# Altium schematic sheet [04] POWER.SchDoc
size A
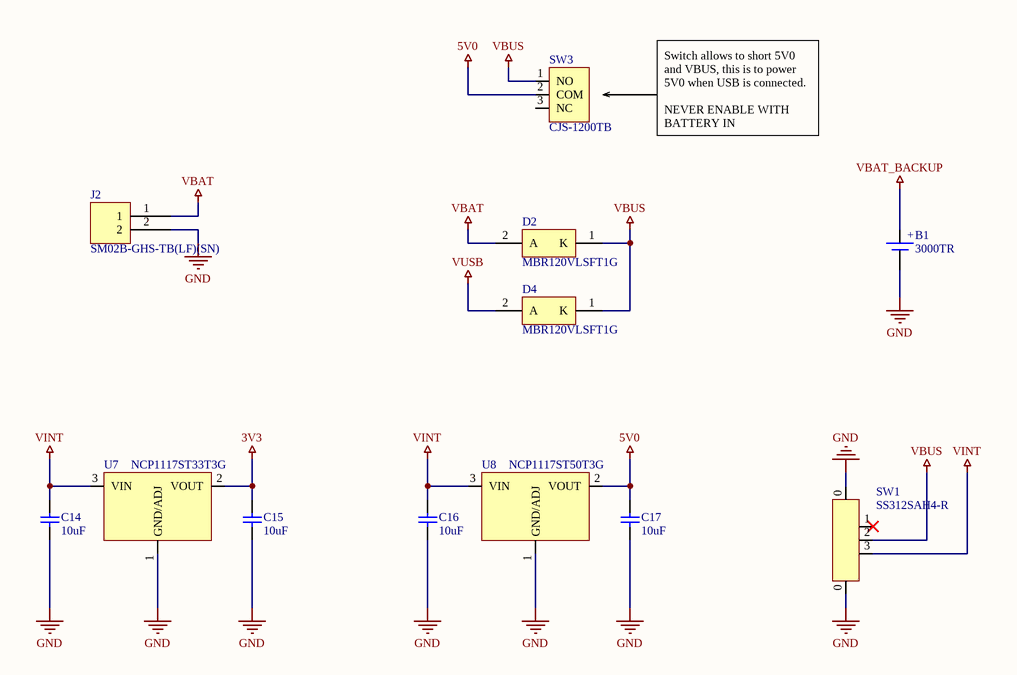
[diagram p0: [04] POWER.SchDoc]

## Parts
B1  3000TR  [3000TR]
C14  10uF  [INCH 0805 - METRIC 2012 - H140]
C15  10uF  [INCH 0805 - METRIC 2012 - H140]
C16  10uF  [INCH 0805 - METRIC 2012 - H140]
C17  10uF  [INCH 0805 - METRIC 2012 - H140]
D2  MBR120VLSFT1G  [ONSC-SOD-123FL-2-498-01_V]
D4  MBR120VLSFT1G  [ONSC-SOD-123FL-2-498-01_V]
J2  SM02B-GHS-TB(LF)(SN)  [SM02B-GHS-TB(LF)(SN)]
SW1  SS312SAH4-R  [NKK_SS312SAH4]
SW3  CJS-1200TB  [NCE_CJS-1200TB]
U7  NCP1117ST33T3G  [SOT223-4P230_700X180L90X70]
U8  NCP1117ST50T3G  [SOT223-4P230_700X180L90X70]

## Nets
3V3: C15.2 U7.2(VOUT)
5V0: C17.2 SW3.2(COM) U8.2(VOUT)
GND: B1.2(-) C14.1 C15.1 C16.1 C17.1 J2.2 SW1.0 U7.1(GND/ADJ) U8.1(GND/ADJ)
VBAT: D2.2(A) J2.1
VBAT_BACKUP: B1.1(+)
VBUS: D2.1(K) D4.1(K) SW1.2 SW3.1(NO)
VINT: C14.2 C16.2 SW1.3 U7.3(VIN) U8.3(VIN)
VUSB: D4.2(A)

Not connected (* = marked no-connect by the designer): SW1 1*; SW3 3(NC)

## Notes on the sheet
- Switch allows to short 5V0 and VBUS, this is to power 5V0 when USB is connected.
  NEVER ENABLE WITH BATTERY IN

## Library data of the parts
B1 = 3000TR: HOLDER BATTERY COIN 12MM DIA SMD; Manufacturer: Keystone Electronics; Connector Type: SMD/SMT; Number of Cells: 1; Supplier 1: Digi-Key; Manufacturer Part Number: 3000TR; RoHS: Yes; Category: Power Management ICs; Stock 1: 23941; Pricing 1: 1=0.91000, 25=0.79880, 100=0.63390, 250=0.58356, 500=0.54802 (USD); Mount: Surface Mount,PCB; Case/Package: SMD/SMT; Material: Bronze; Color: Silver; Packaging: Tape and Reel; Package Quantity: 1; Termination: SMD/SMT; Number of Batteries: 1; Diameter: 12mm; Lead Free: Lead Free; ComponentLink1URL: https://datasheet.ciiva.com/3/3000-3936.pdf?src-supplier=Digi-Key; ComponentLink1Description: https://datasheet.ciiva.com/3/3000-3936.pdf?src-supplier=Digi-Key; ComponentLink2URL: https://datasheet.ciiva.com/3/3000tr-3935.pdf?src-supplier=Digi-Key; ComponentLink2Description: https://datasheet.ciiva.com/3/3000tr-3935.pdf?src-supplier=Digi-Key; ComponentLink3URL: https://datasheet.ciiva.com/16305/m60-2p7-16305915.pdf?src-supplier=Future+Electronics; ComponentLink3Description: https://datasheet.ciiva.com/16305/m60-2p7-16305915.pdf?src-supplier=Future+Electronics; ComponentLink4URL: https://datasheet.ciiva.com/3/3000tr-3937.pdf?src-supplier=Digi-Key; ComponentLink4Description: https://datasheet.ciiva.com/3/3000tr-3937.pdf?src-supplier=Digi-Key; Supplier Part Number 1: 36-3000CT-ND
C14-C17 = GRM21BR61E106MA73L: CAP CER 10UF 25V X5R 0805; Manufacturer: Murata; Tolerance: 20%; Supplier 1: Digi-Key; Manufacturer Part Number: GRM21BR61E106MA73L; Stock 1: 30000; Pricing 1: 1=0.27, 10=0.184, 100=0.1044, 500=0.0737, 1000=0.06449 (USD); Mount: Surface Mount; Case/Package: 0805; Weight: 0.000335oz; Case Code (Metric): 2012; Case Code (Imperial): 0805; Min Operating Temperature: -55°C; Max Operating Temperature: 85°C; Capacitance: 10uF; Packaging: Tape and Reel; Dielectric: X5R; Voltage Rating: 25V; Termination: SMD/SMT; Composition: Ceramic; Voltage Rating (DC): 25V; Package Quantity: 3000; Length: 2mm; Height: 1.25mm; Width: 0.049inch; Thickness: 0.055inch; Depth: 1.25mm; REACH SVHC: No SVHC; Lead Free: Lead Free; Supplier Part Number 1: 490-10748-1-ND
D2 D4 = CMP-1055-00449-1: Schottky Power Rectifier, 2-Pin SOD-123, Pb-Free, Tape and Reel; Manufacturer: On Semiconductor; IFSM Max (A): 45; Configuration: Single; PackageDescription: 2-Pin SOD, Body 1.65 x 2.7 mm; RoHS: TRUE; ComponentLink2URL: http://www.onsemi.cn/pub_link/Collateral/MBR120VLSFT1-D.PDF; Mounting Technology: Surface Mount; ComponentLink1Description: Manufacturer URL; DatasheetVersion: Rev. 2; ComponentLink3Description: Package Specification; Packing: Tape and Reel; ComponentLink2Description: Datasheet; ComponentLink1URL: http://www.onsemi.com/; PackageVersion: Rev. A; PackageReference: SOD-123FL-2-498-01; ComponentLink3URL: http://www.onsemi.cn/pub_link/Collateral/MBR120VLSFT1-D.PDF; PartNumber: MBR120VLSFT1G
J2 = SM02B-GHS-TB(LF)(SN): Connector Header, GH Series, 2 Position, 1.25mm, 30-26 AWG, 50V, Surface Mount, Right Angle, Solder, Locking Ramp; Manufacturer: JST; Number of Positions: 2; Connector Type: Outer Shroud Contact; Current Rating: 1A; Pitch: 0.049inch; Supplier 1: Digi-Key; Manufacturer Part Number: SM02B-GHS-TB(LF)(SN); RoHS: Yes; Category: Headers and Wire Housings; Stock 1: 14162; Pricing 1: 1=0.46000, 10=0.43800, 100=0.30670, 500=0.26292, 1000=0.21910 (USD); Mount: Surface Mount; Housing Material: Nylon; Color: Natural; Contact Material: Bronze; Housing Color: Natural; Contact Plating: Tin; Number of Rows: 1; Fastening Type: Ramp; Packaging: Tape and Reel; Termination: Solder; Number of Contacts: 2; Voltage Rating: 50V; Orientation: Right Angle; Lead Free: Lead Free; ComponentLink1URL: https://datasheet.ciiva.com/25617/0900766b810cef17-25617252.pdf?src-supplier=RSComponents; ComponentLink1Description: https://datasheet.ciiva.com/25617/0900766b810cef17-25617252.pdf?src-supplier=RSComponents; ComponentLink2URL: https://datasheet.ciiva.com/730/egh-730691.pdf?src-supplier=Digi-Key; ComponentLink2Description: https://datasheet.ciiva.com/730/egh-730691.pdf?src-supplier=Digi-Key; ComponentLink3URL: https://datasheet.ciiva.com/712/egh-712452.pdf?src-supplier=Digi-Key; ComponentLink3Description: https://datasheet.ciiva.com/712/egh-712452.pdf?src-supplier=Digi-Key; ComponentLink4URL: https://datasheet.ciiva.com/16345/jstsm02b-ghs-tb-lf-sn-16345351.pdf?src-supplier=Future+Electronics; ComponentLink4Description: https://datasheet.ciiva.com/16345/jstsm02b-ghs-tb-lf-sn-16345351.pdf?src-supplier=Future+Electronics; Supplier Part Number 1: 455-1564-1-ND
SW1 = SS312SAH4-R: SWITCH SLIDE SPDT 0.4VA 28V; Manufacturer: NKK Switches; Actuator Material: Polyphenylene; Mechanical Life: 10000Cycles; Max Current Rating: 100mA; Switch Travel: 2mm; Switch Function: On-On; Actuator Type: Standard; Supplier 1: Digi-Key; Manufacturer Part Number: SS312SAH4-R; RoHS: Yes; Stock 1: 6697; Pricing 1: 1 = 3.33000, 10 = 3.18800, 25 = 3.04920, 50 = 2.70280, 100 = 2.63340, 250 = 2.59876 (USD); Mount: Surface Mount; Case/Package: SMD/SMT; Contact Material: Bronze; Contact Plating: Gold,Silver; Housing Material: Bronze; Min Operating Temperature: -25°C; Max Operating Temperature: 85°C; Packaging: Tape and Reel; Package Quantity: 500; Throw Configuration: SPDT; Voltage Rating (AC): 28V; Max Voltage Rating (AC): 28V; Max Voltage Rating (DC): 28V; Termination: Gull Wing; Voltage Rating (DC): 28V; Electrical Life: 10000Cycles; Orientation: Right Angle; Length: 10.5mm; Depth: 7.45mm; Actuator Length: 2mm; Lead Free: Lead Free; REACH SVHC: No SVHC; ComponentLink1URL: http://www.farnell.com/datasheets/1783587.pdf?src-supplier=Element14; ComponentLink1Description: http://www.farnell.com/datasheets/1783587.pdf?src-supplier=Element14; Supplier Part Number 1: 360-2924-1-ND
SW3 = CJS-1200TB: SWITCH SLIDE SPDT 100MA 6V; Manufacturer: Nidec Copal; Body Material: Polyphenylene; Max Voltage Rating (DC): 24V; Number of Positions: 2; Electrical Life: 200Cycles; Washable: Yes; Supplier 1: Digi-Key; Manufacturer Part Number: CJS-1200TB; Stock 1: 0; Mount: Surface Mount; Contact Material: Copper Alloy; Contact Plating: Gold; Min Operating Temperature: -40°C; Max Operating Temperature: 85°C; Throw Configuration: SPDT; Packaging: Tape and Reel; Termination: Gull Wing; Voltage Rating (DC): 6V; Current Rating: 100mA; Orientation: Vertical; Length: 0.212inch; Radiation Hardening: No; Lead Free: Lead Free; ComponentLink1URL: https://datasheet.ciiva.com/2865/cjs-2865057.pdf; ComponentLink1Description: https://datasheet.ciiva.com/2865/cjs-2865057.pdf; ComponentLink2URL: https://datasheet.ciiva.com/2865/cjs-2865058.pdf; ComponentLink2Description: https://datasheet.ciiva.com/2865/cjs-2865058.pdf; ComponentLink3URL: https://datasheet.ciiva.com/2865/cjs-2865059.pdf; ComponentLink3Description: https://datasheet.ciiva.com/2865/cjs-2865059.pdf; Supplier Part Number 1: 563-1022-1-ND
U7 = NCP1117ST33T3G: IC REG LINEAR 3.3V 1A SOT223; Manufacturer: ON Semiconductor; Max Input Voltage: 20V; Number of Outputs: 1; Dropout Voltage: 1.07V; Max Supply Voltage: 15V; Min Supply Voltage: 4.75V; Min Input Voltage: 3.5V; Input Bias Current: 6mA; Quiescent Current: 10mA; Polarity: Positive; Reference Voltage: 1.25V; Accuracy: 1%; Output Type: Fixed; Supplier 1: Digi-Key; Manufacturer Part Number: NCP1117ST33T3G; RoHS: Yes; Stock 1: 60671; Pricing 1: 1 = 0.52000, 10 = 0.44400, 100 = 0.33150, 500 = 0.26048, 1000 = 0.20129 (USD); Mount: Surface Mount; Case/Package: SOT-223; Number of Pins: 3; Contact Plating: Tin; Min Operating Temperature: 0°C; Max Operating Temperature: 125°C; Output Voltage: 3.3V; Packaging: Tape and Reel; Output Current: 1A; Max Output Current: 1A; Package Quantity: 1; Nominal Output Voltage: 3.3V; Number of Regulators: 1; Min Current Limit: 1A; Min Output Voltage: 3.3V; Max Output Voltage: 3.3V; Termination: SMD/SMT; Output Voltage Accuracy: 1%; Length: 6.7mm; Height: 1.69mm; Width: 3.7mm; Radiation Hardening: No; REACH SVHC: No SVHC; Lead Free: Lead Free; Halogen Free: Halogen Free; ComponentLink1URL: https://datasheet.ciiva.com/3224/ncp1117-d-3224144.pdf?src-supplier=Avnet; ComponentLink1Description: https://datasheet.ciiva.com/3224/ncp1117-d-3224144.pdf?src-supplier=Avnet; ComponentLink2URL: https://datasheet.ciiva.com/22697/1726422-22697602.pdf?src-supplier=Element14; ComponentLink2Description: https://datasheet.ciiva.com/22697/1726422-22697602.pdf?src-supplier=Element14; ComponentLink3URL: https://datasheet.ciiva.com/15111/getdatasheetpartid-82718-15111483.pdf?src-supplier=Verical; ComponentLink3Description: https://datasheet.ciiva.com/15111/getdatasheetpartid-82718-15111483.pdf?src-supplier=Verical; ComponentLink4URL: https://datasheet.ciiva.com/8233/ncp1117-d-8233589.pdf?src-supplier=Avnet; ComponentLink4Description: https://datasheet.ciiva.com/8233/ncp1117-d-8233589.pdf?src-supplier=Avnet; ComponentLink5URL: https://datasheet.ciiva.com/2042/ncp1117-d-2042027.pdf?src-supplier=Digi-Key; ComponentLink5Description: https://datasheet.ciiva.com/2042/ncp1117-d-2042027.pdf?src-supplier=Digi-Key; ComponentLink6URL: https://datasheet.ciiva.com/2042/ncp1117-d-2042028.pdf?src-supplier=Digi-Key; ComponentLink6Description: https://datasheet.ciiva.com/2042/ncp1117-d-2042028.pdf?src-supplier=Digi-Key; ComponentLink7URL: https://datasheet.ciiva.com/2042/ncp1117-d-2042029.pdf?src-supplier=Digi-Key; ComponentLink7Description: https://datasheet.ciiva.com/2042/ncp1117-d-2042029.pdf?src-supplier=Digi-Key; ComponentLink8URL: https://datasheet.ciiva.com/8073/1726422-8073735.pdf?src-supplier=Element14; ComponentLink8Description: https://datasheet.ciiva.com/8073/1726422-8073735.pdf?src-supplier=Element14; ComponentLink9URL: https://datasheet.ciiva.com/28483/1748260-28483307.pdf?src-supplier=Element14; ComponentLink9Description: https://datasheet.ciiva.com/28483/1748260-28483307.pdf?src-supplier=Element14; ComponentLink10URL: https://datasheet.ciiva.com/16382/ncp1117-d-16382636.pdf?src-supplier=Future+Electronics; ComponentLink10Description: https://datasheet.ciiva.com/16382/ncp1117-d-16382636.pdf?src-supplier=Future+Electronics; Supplier Part Number 1: NCP1117ST33T3GOSCT-ND
U8 = NCP1117ST50T3G: IC REG LINEAR 5V 1A SOT223; Manufacturer: ON Semiconductor; Number of Outputs: 1; Max Input Voltage: 20V; Min Input Voltage: 3.5V; Dropout Voltage: 1.2V; Input Bias Current: 6mA; Polarity: Positive; Quiescent Current: 10mA; Output Voltage Accuracy: 1%; Power Rating: 781mW; Output Type: Fixed; Supplier 1: Digi-Key; Manufacturer Part Number: NCP1117ST50T3G; RoHS: Yes; Stock 1: 20727; Pricing 1: 1 = 0.54000, 10 = 0.45800, 100 = 0.34230, 500 = 0.26896, 1000 = 0.20783 (USD); Case/Package: SOT-223; Number of Pins: 4; Contact Plating: Tin; Min Operating Temperature: 0°C; Max Operating Temperature: 125°C; Package Quantity: 1; Output Voltage: 5V; Output Current: 1A; Max Output Current: 1A; Nominal Output Voltage: 5V; Packaging: Tape and Reel; Number of Regulators: 1; Min Current Limit: 1A; Accuracy: 1%; Tolerance: 1%; Length: 6.7mm; Height: 1.69mm; Width: 3.7mm; Radiation Hardening: No; REACH SVHC: No SVHC; Lead Free: Lead Free; Halogen Free: Halogen Free; ComponentLink1URL: https://datasheet.ciiva.com/28483/1748260-28483320.pdf?src-supplier=Element14; ComponentLink1Description: https://datasheet.ciiva.com/28483/1748260-28483320.pdf?src-supplier=Element14; ComponentLink2URL: https://datasheet.ciiva.com/2042/ncp1117-d-2042018.pdf?src-supplier=Digi-Key; ComponentLink2Description: https://datasheet.ciiva.com/2042/ncp1117-d-2042018.pdf?src-supplier=Digi-Key; ComponentLink3URL: https://datasheet.ciiva.com/2042/ncp1117-d-2042019.pdf?src-supplier=Digi-Key; ComponentLink3Description: https://datasheet.ciiva.com/2042/ncp1117-d-2042019.pdf?src-supplier=Digi-Key; ComponentLink4URL: https://datasheet.ciiva.com/2042/ncp1117-d-2042020.pdf?src-supplier=Digi-Key; ComponentLink4Description: https://datasheet.ciiva.com/2042/ncp1117-d-2042020.pdf?src-supplier=Digi-Key; ComponentLink5URL: https://datasheet.ciiva.com/25978/ncp1117-d-25978293.pdf?src-supplier=Avnet+Europe; ComponentLink5Description: https://datasheet.ciiva.com/25978/ncp1117-d-25978293.pdf?src-supplier=Avnet+Europe; ComponentLink6URL: https://datasheet.ciiva.com/16491/ncp1117-d-16491895.pdf?src-supplier=Avnet+Asia; ComponentLink6Description: https://datasheet.ciiva.com/16491/ncp1117-d-16491895.pdf?src-supplier=Avnet+Asia; ComponentLink7URL: https://datasheet.ciiva.com/8073/ncp1117-d-8073736.pdf?src-supplier=Element14; ComponentLink7Description: https://datasheet.ciiva.com/8073/ncp1117-d-8073736.pdf?src-supplier=Element14; ComponentLink8URL: https://datasheet.ciiva.com/8233/ncp1117-d-8233593.pdf?src-supplier=Avnet; ComponentLink8Description: https://datasheet.ciiva.com/8233/ncp1117-d-8233593.pdf?src-supplier=Avnet; ComponentLink9URL: https://datasheet.ciiva.com/16209/ncp1117-d-16209561.pdf?src-supplier=Future+Electronics; ComponentLink9Description: https://datasheet.ciiva.com/16209/ncp1117-d-16209561.pdf?src-supplier=Future+Electronics; ComponentLink10URL: https://datasheet.ciiva.com/8231/ncp1117-d-8231068.pdf?src-supplier=Avnet; ComponentLink10Description: https://datasheet.ciiva.com/8231/ncp1117-d-8231068.pdf?src-supplier=Avnet; ComponentLink11URL: https://datasheet.ciiva.com/8073/ncp1117-d-8073902.pdf?src-supplier=Element14; ComponentLink11Description: https://datasheet.ciiva.com/8073/ncp1117-d-8073902.pdf?src-supplier=Element14; Supplier Part Number 1: NCP1117ST50T3GOSCT-ND